# Altium schematic sheet H615PWR.SchDoc
size A4
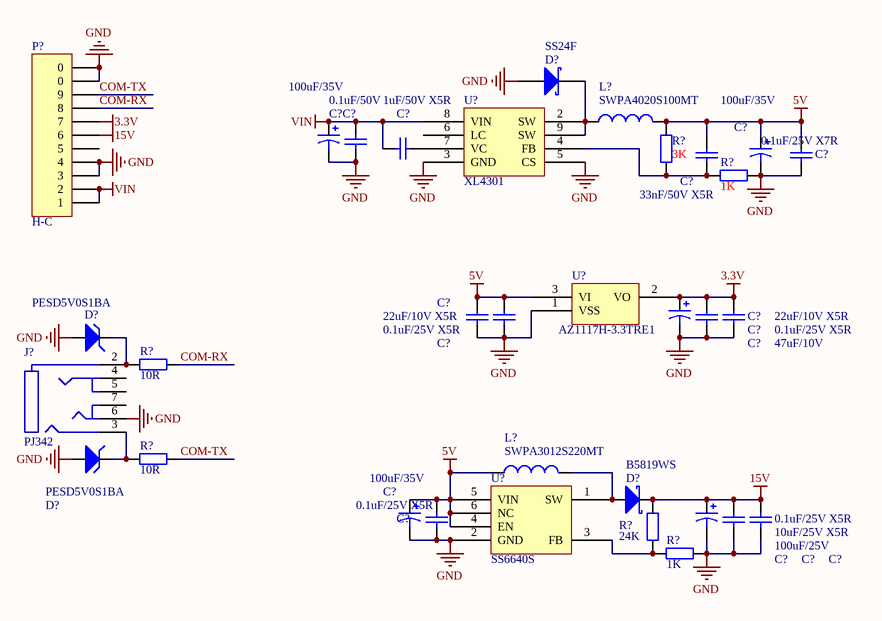
[diagram p0: H615PWR.SchDoc]

## Parts
(Parts that share a designator on the sheet are numbered #1, #2 ... from top to bottom, then left to right.)
C?#1  100uF/35V  [CAP-SMD-6.3x7.7]
C?#2  0.1uF/50V  [C-0603]
C?#3  33nF/50V X5R  [C-0603]
C?#4  100uF/35V  [CAP-SMD-6.3x7.7]
C?#5  0.1uF/25V X7R  [C-0603]
C?#6  1uF/50V X5R  [C-0603]
C?#7  47uF/10V  [CAP-SMD-4X5.4]
C?#8  22uF/10V X5R  [C-0603]
C?#9  0.1uF/25V X5R  [C-0402]
C?#10  22uF/10V X5R  [C-0603]
C?#11  0.1uF/25V X5R  [C-0402]
C?#12  100uF/35V  [CAP-SMD-6.3x7.7]
C?#13  0.1uF/25V X5R  [C-0402]
C?#14  100uF/25V  [CAPPR-5x7-LIE]
C?#15  10uF/25V X5R  [C-0805]
C?#16  0.1uF/25V X5R  [C-0402]
D?#1  SS24F  [SMAF]
D?#2  PESD5V0S1BA  [SOD-323]
D?#3  PESD5V0S1BA  [SOD-323]
D?#4  B5819WS  [SOD-323]
J?  PJ342  [PJ342]
L?#1  SWPA4020S100MT  [SWPA4020S]
L?#2  SWPA3012S220MT  [SWPA3012S]
P?  H-C  [1.25T-9AB]
R?#1  3K  [R-0603]
R?#2  1K  [R-0603]
R?#3  10R  [R-0603]
R?#4  10R  [R-0603]
R?#5  24K  [R-0402]
R?#6  1K  [R-0402]
U?#1  XL4301  [SOIC8E]
U?#2  AZ1117H-3.3TRE1  [SOT-223]
U?#3  SS6640S  [SOT23-6]

## Nets
3.3V: C?#7.1 C?#10.2 C?#11.2 P?.7 U?#2.2(VO)
5V: C?#3.1 C?#4.1 C?#5.1 C?#8.2 C?#9.2 C?#12.1 C?#13.1 L?#1.2 L?#2.1 R?#1.1 U?#2.3(VI) U?#3.4(EN) U?#3.5(VIN) U?#3.6(NC)
15V: C?#14.1 C?#15.2 C?#16.2 D?#4.2(K) P?.6 R?#5.1
GND: C?#1.2 C?#2.1 C?#4.2 C?#5.2 C?#7.2 C?#8.1 C?#9.1 C?#10.1 C?#11.1 C?#12.2 C?#13.2 C?#14.2 C?#15.1 C?#16.1 D?#1.1(A) D?#2.1(A) D?#3.1(A) J?.6 P?.0 P?.3 P?.4 R?#2.2 R?#6.1 U?#1.3(GND) U?#1.5(CS) U?#2.1(VSS) U?#3.2(GND)
VIN: C?#1.1 C?#2.2 C?#6.2 P?.1 P?.2 U?#1.8(VIN)
COM-RX: P?.8 R?#3.1
COM-TX: P?.9 R?#4.2
NetC?#3_2: C?#3.2 R?#1.2 R?#2.1 U?#1.4(FB)
NetC?#6_1: C?#6.1 U?#1.7(VC)
NetD?#1_2: D?#1.2(K) L?#1.1 U?#1.2(SW) U?#1.9(SW)
NetD?#2_2: D?#2.2(K) J?.2 R?#3.2
NetD?#3_2: D?#3.2(K) J?.3 R?#4.1
NetD?#4_1: D?#4.1(A) L?#2.2 U?#3.1(SW)
NetR?#5_2: R?#5.2 R?#6.2 U?#3.3(FB)

Not connected (* = marked no-connect by the designer): J? 4 5 7; P? 5; U?#1 6(LC)

## Library data of the parts
C?#1 C?#4 C?#7 C?#12 C?#14 = Cap Pol1: Polarized Capacitor (Radial); Published: 8-Jun-2000; LatestRevisionDate: 17-Jul-2002; LatestRevisionNote: Re-released for DXP Platform.; PackageReference: RB7.6-15; Publisher: Altium Limited; PackageDescription: Polarized Capacitor (Radial); 2 Leads
  C?#1 C?#4 C?#12: Value: 100uF/35V
  C?#7: Value: 47uF/10V
  C?#14: Value: 100uF/25V
C?#2 C?#3 C?#5 C?#6 C?#8-C?#11 C?#13 C?#15 C?#16 = Cap: Capacitor; Published: 8-Jun-2000; LatestRevisionDate: 17-Jul-2002; LatestRevisionNote: Re-released for DXP Platform.; PackageReference: RAD-0.3; Publisher: Altium Limited
  C?#2: PackageDescription: Radial Cap, Thru-Hole; 2 Leads; 0.3 in Pin Spacing; Value: 0.1uF/50V
  C?#3: PackageDescription: Radial Cap, Thru-Hole; 2 Leads; 0.3 in Pin Spacing; Value: 33nF/50V X5R
  C?#5: PackageDescription: Radial Cap, Thru-Hole; 2 Leads; 0.3 in Pin Spacing; Value: 0.1uF/25V X7R
  C?#6: PackageDescription: Radial Cap, Thru-Hole; 2 Leads; 0.3 in Pin Spacing; Value: 1uF/50V X5R
  C?#8 C?#10: PackageDescription: Radial Cap, Thru-Hole; 2 Leads; 0.3 in Pin Spacing; Value: 22uF/10V X5R
  C?#9: Value: 0.1uF/25V X5R
  C?#11 C?#13 C?#16: PackageDescription: Radial Cap, Thru-Hole; 2 Leads; 0.3 in Pin Spacing; Value: 0.1uF/25V X5R
  C?#15: PackageDescription: Radial Cap, Thru-Hole; 2 Leads; 0.3 in Pin Spacing; Value: 10uF/25V X5R
D?#1 D?#4 = D Schottky: Schottky Diode; Manufacturer: Generic Components; Class: Discrete; SubClass: Diode - Schottky; Published: 08/06/2000; Publisher: Altium Hobart Technology Centre
D?#2 D?#3 = D Zener: Zener Diode; Published: 8-Jun-2000; LatestRevisionDate: 17-Jul-2002; LatestRevisionNote: Re-released for DXP Platform.; PackageReference: DIODE-0.7; Publisher: Altium Limited; PackageDescription: Diode, Thru-Hole; 2 Leads; 0.7 in Pin Spacing
L?#1 L?#2 = Inductor: Code_IEC: 1005; Published: 8-Jun-2000; LatestRevisionDate: 29-May-2009; LatestRevisionNote: IPC-7351 Footprint Added.; PackageReference: 0402-A; Publisher: Altium Limited; PackageDescription: Chip Inductor; Code_JEITA: 0402
  L?#1: Value: SWPA4020S100MT
  L?#2: Value: SWPA3012S220MT
P? = Header 11: Header, 11-Pin; LatestRevisionDate: 17-Jul-2002; LatestRevisionNote: Re-released for DXP Platform.; Publisher: Altium Limited
R?#1-R?#6 = Res2: Resistor; Published: 8-Jun-2000; LatestRevisionDate: 17-Jul-2002; LatestRevisionNote: Re-released for DXP Platform.; PackageReference: AXIAL-0.4; Publisher: Altium Limited
  R?#1: Value: 3K
  R?#2 R?#6: Value: 1K
  R?#3 R?#4: Value: 10R
  R?#5: Value: 24K
U?#2 = BL8503-SM: LDO
U?#3 = AX5523